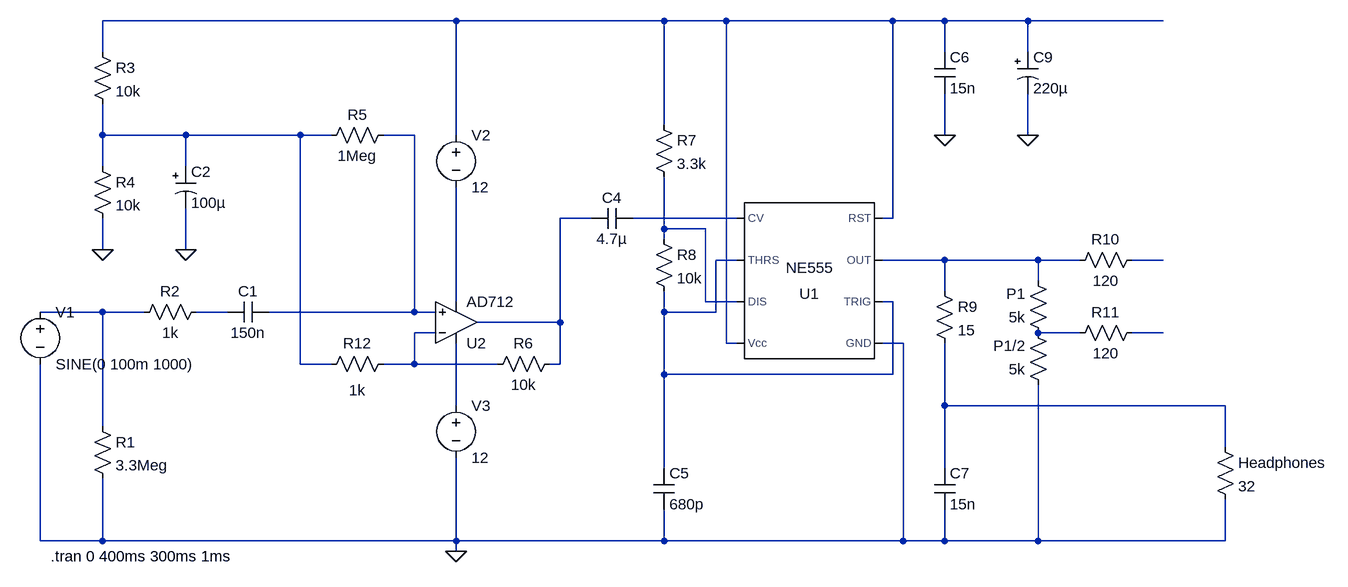
[diagram p0: schematic Draft2.asc]
Draft2.asc, the LTspice schematic file:
Version 4
SHEET 1 880 680
WIRE -752 -208 -1296 -208
WIRE -432 -208 -752 -208
WIRE -336 -208 -432 -208
WIRE -80 -208 -336 -208
WIRE 0 -208 -80 -208
WIRE 128 -208 0 -208
WIRE 336 -208 128 -208
WIRE -1296 -160 -1296 -208
WIRE 0 -160 0 -208
WIRE 128 -160 128 -208
WIRE -432 -48 -432 -208
WIRE -1296 -32 -1296 -80
WIRE -1168 -32 -1296 -32
WIRE -992 -32 -1168 -32
WIRE -944 -32 -992 -32
WIRE -816 -32 -864 -32
WIRE -752 -32 -752 -208
WIRE 0 -32 0 -96
WIRE 128 -32 128 -96
WIRE -1296 16 -1296 -32
WIRE -1168 16 -1168 -32
WIRE -544 96 -592 96
WIRE -320 96 -480 96
WIRE -80 96 -80 -208
WIRE -80 96 -96 96
WIRE -432 112 -432 32
WIRE -368 112 -432 112
WIRE -432 128 -432 112
WIRE -1296 144 -1296 96
WIRE -1168 144 -1168 80
WIRE -320 160 -352 160
WIRE 0 160 -96 160
WIRE 144 160 0 160
WIRE 208 160 144 160
WIRE 336 160 288 160
WIRE 144 192 144 160
WIRE 0 208 0 160
WIRE -752 224 -752 48
WIRE -368 224 -368 112
WIRE -320 224 -368 224
WIRE -80 224 -96 224
WIRE -1296 240 -1392 240
WIRE -1232 240 -1296 240
WIRE -1104 240 -1152 240
WIRE -816 240 -816 -32
WIRE -816 240 -1040 240
WIRE -784 240 -816 240
WIRE -432 240 -432 208
WIRE -352 240 -352 160
WIRE -352 240 -432 240
WIRE -592 256 -592 96
WIRE -592 256 -720 256
WIRE -784 272 -816 272
WIRE 208 272 144 272
WIRE 336 272 288 272
WIRE -336 288 -336 -208
WIRE -320 288 -336 288
WIRE -64 288 -96 288
WIRE -992 320 -992 -32
WIRE -944 320 -992 320
WIRE -816 320 -816 272
WIRE -816 320 -864 320
WIRE -688 320 -816 320
WIRE -592 320 -592 256
WIRE -592 320 -608 320
WIRE -432 336 -432 240
WIRE -80 336 -80 224
WIRE -80 336 -432 336
WIRE -752 384 -752 288
WIRE 0 384 0 288
WIRE 432 384 0 384
WIRE -1296 416 -1296 240
WIRE 432 448 432 384
WIRE -432 480 -432 336
WIRE 0 480 0 384
WIRE -1392 592 -1392 320
WIRE -1296 592 -1296 496
WIRE -1296 592 -1392 592
WIRE -752 592 -752 464
WIRE -752 592 -1296 592
WIRE -432 592 -432 544
WIRE -432 592 -752 592
WIRE -64 592 -64 288
WIRE -64 592 -432 592
WIRE 0 592 0 544
WIRE 0 592 -64 592
WIRE 144 592 144 352
WIRE 144 592 0 592
WIRE 432 592 432 528
WIRE 432 592 144 592
WIRE -752 608 -752 592
FLAG -1296 144 0
FLAG -1168 144 0
FLAG -752 608 0
FLAG 0 -32 0
FLAG 128 -32 0
SYMBOL Misc\\NE555 -208 192 R180
SYMATTR InstName U1
SYMBOL res -1312 400 R0
SYMATTR InstName R1
SYMATTR Value 3.3Meg
SYMBOL res -1136 224 R90
WINDOW 0 0 56 VBottom 2
WINDOW 3 32 56 VTop 2
SYMATTR InstName R2
SYMATTR Value 1k
SYMBOL cap -1040 224 R90
WINDOW 0 0 32 VBottom 2
WINDOW 3 32 32 VTop 2
SYMATTR InstName C1
SYMATTR Value 150n
SYMBOL res -1312 0 R0
SYMATTR InstName R4
SYMATTR Value 10k
SYMBOL res -1312 -176 R0
SYMATTR InstName R3
SYMATTR Value 10k
SYMBOL polcap -1184 16 R0
SYMATTR InstName C2
SYMATTR Value 100µ
SYMATTR SpiceLine V=16
SYMBOL res -848 -48 R90
WINDOW 0 0 56 VBottom 2
WINDOW 3 32 56 VTop 2
SYMATTR InstName R5
SYMATTR Value 1Meg
SYMBOL res -848 304 R90
WINDOW 0 0 56 VBottom 2
WINDOW 3 41 56 VTop 2
SYMATTR InstName R12
SYMATTR Value 1k
SYMBOL res -592 304 R90
WINDOW 0 0 56 VBottom 2
WINDOW 3 32 56 VTop 2
SYMATTR InstName R6
SYMATTR Value 10k
SYMBOL cap -480 80 R90
WINDOW 0 0 32 VBottom 2
WINDOW 3 32 32 VTop 2
SYMATTR InstName C4
SYMATTR Value 4.7µ
SYMBOL res -448 -64 R0
SYMATTR InstName R7
SYMATTR Value 3.3k
SYMBOL res -448 112 R0
SYMATTR InstName R8
SYMATTR Value 10k
SYMBOL cap -448 480 R0
SYMATTR InstName C5
SYMATTR Value 680p
SYMBOL res -16 192 R0
SYMATTR InstName R9
SYMATTR Value 15
SYMBOL cap -16 480 R0
SYMATTR InstName C7
SYMATTR Value 15n
SYMBOL cap -16 -160 R0
SYMATTR InstName C6
SYMATTR Value 15n
SYMBOL polcap 112 -160 R0
SYMATTR InstName C9
SYMATTR Value 220µ
SYMATTR SpiceLine V=16
SYMBOL res 304 144 R90
WINDOW 0 0 56 VBottom 2
WINDOW 3 32 56 VTop 2
SYMATTR InstName R10
SYMATTR Value 120
SYMBOL res 160 288 R180
WINDOW 0 36 76 Left 2
WINDOW 3 36 40 Left 2
SYMATTR InstName P1
SYMATTR Value 5k
SYMBOL res 160 368 R180
WINDOW 0 36 76 Left 2
WINDOW 3 36 40 Left 2
SYMATTR InstName P1/2
SYMATTR Value 5k
SYMBOL res 304 256 R90
WINDOW 0 0 56 VBottom 2
WINDOW 3 32 56 VTop 2
SYMATTR InstName R11
SYMATTR Value 120
SYMBOL res 416 432 R0
SYMATTR InstName Headphones
SYMATTR Value 32
SYMBOL voltage -1392 224 R0
WINDOW 123 0 0 Left 0
WINDOW 39 0 0 Left 0
SYMATTR InstName V1
SYMATTR Value SINE(0 100m 1000)
SYMBOL voltage -752 -48 R0
WINDOW 123 0 0 Left 0
WINDOW 39 0 0 Left 0
SYMATTR InstName V2
SYMATTR Value 12
SYMBOL voltage -752 368 R0
WINDOW 123 0 0 Left 0
WINDOW 39 0 0 Left 0
SYMATTR InstName V3
SYMATTR Value 12
SYMBOL OpAmps\\AD712 -752 320 M180
SYMATTR InstName U2
TEXT -1376 616 Left 2 !.tran 0 400ms 300ms 1ms

The netlist it stands for:
* Draft2.asc
XU1 0 N007 N008 N001 N005 N007 N006 N001 NE555  ; pins GND TRIG OUT RST CV THRS DIS Vcc
R1 N011 0 3.3Meg
R2 N012 N011 1k
C1 N003 N012 150n
R4 N002 0 10k
R3 N001 N002 10k
C2 N002 0 100µ V=16
R5 N003 N002 1Meg
R12 N013 N002 1k
R6 N004 N013 10k
C4 N005 N004 4.7µ
R7 N001 N006 3.3k
R8 N006 N007 10k
C5 N007 0 680p
R9 N008 N017 15
C7 N017 0 15n
C6 N001 0 15n
C9 N001 0 220µ V=16
R10 N009 N008 120
R§P1 N014 N008 5k
R§P1/2 0 N014 5k
R11 N015 N014 120
R§Headphones N017 0 32
V1 N011 0 SINE(0 100m 1000)
V2 N001 N010 12
V3 N016 0 12
XU2 N003 N013 N016 N010 N004 AD712  ; pins In+ In- V+ V- OUT
.tran 0 400ms 300ms 1ms
.lib NE555.sub
.backanno
.end